# EAGLE design PowerCircuit (EAGLE 8.4.1)
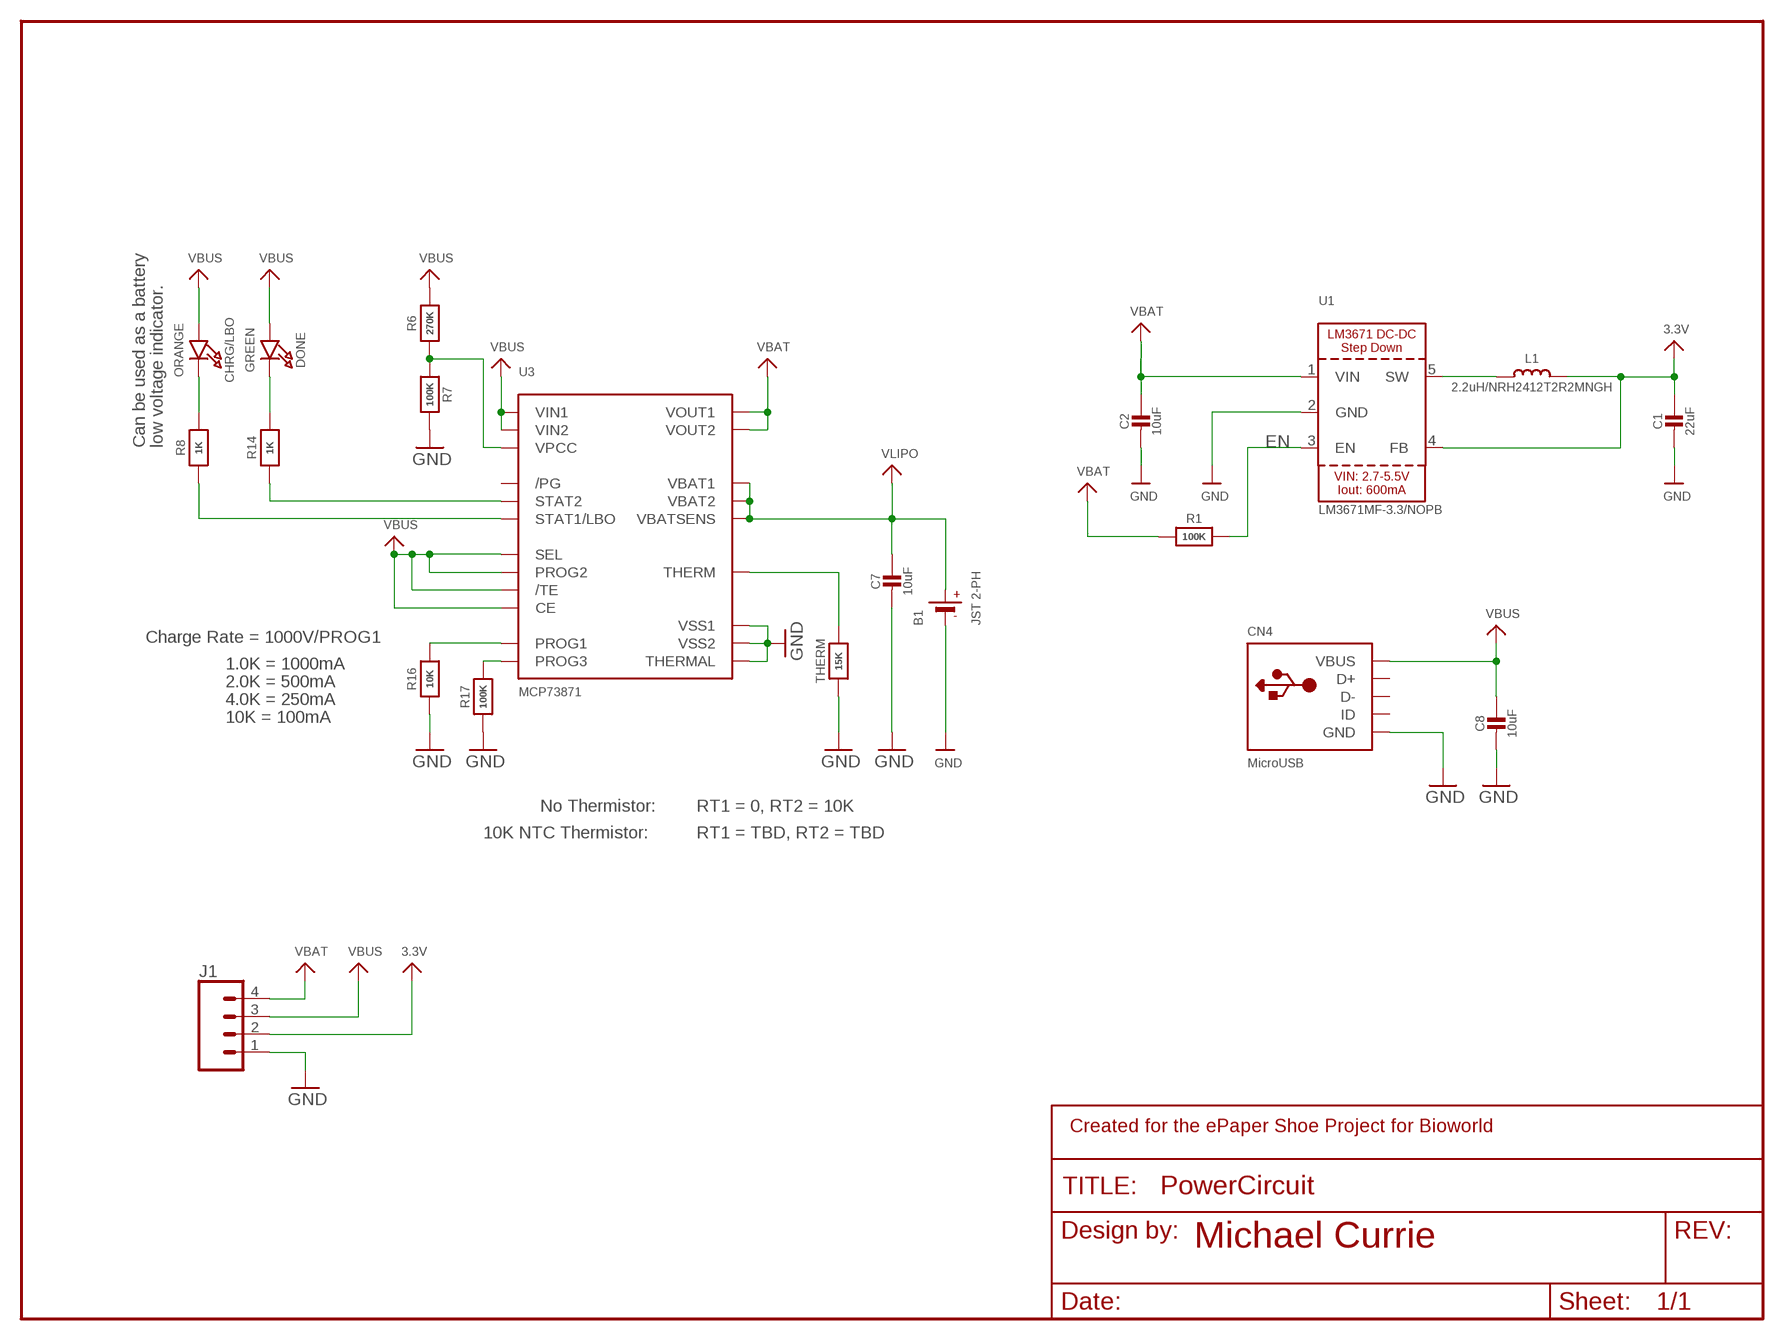
[diagram p0: schematic, sheet 1]

## Parts
B1  JST 2-PH  BATTERY  [JSTPH2]
C1  22uF  CAP_CERAMIC0805-NOOUTLINE  [0805-NO]
C2  10uF  CAP_CERAMIC0805-NOOUTLINE  [0805-NO]
C7  10uF  CAP_CERAMIC0805-NOOUTLINE  [0805-NO]
C8  10uF  CAP_CERAMIC0805-NOOUTLINE  [0805-NO]
CHRG/LBO  ORANGE  LED0805_NOOUTLINE  [CHIPLED_0805_NOOUTLINE]
CN4  MicroUSB  USBMICRO_20329  [4UCONN_20329]
DONE  GREEN  LED0805_NOOUTLINE  [CHIPLED_0805_NOOUTLINE]
FRAME1  FRAME-LETTER-MICHAELNO_PACKAGE  [DUMMY]
J1  CONN_04  [1X04]
L1  2.2uH/NRH2412T2R2MNGH  INDUCTORNRH2412T  [INDUCTOR_TAIYOYUDEN_NRH2412T]
R1  100K  RESISTOR0805_NOOUTLINE  [0805-NO]
R6  270K  RESISTOR0805_NOOUTLINE  [0805-NO]
R7  100K  RESISTOR0805_NOOUTLINE  [0805-NO]
R8  1K  RESISTOR0805_NOOUTLINE  [0805-NO]
R14  1K  RESISTOR0805_NOOUTLINE  [0805-NO]
R16  10K  RESISTOR0805_NOOUTLINE  [0805-NO]
R17  100K  RESISTOR0805_NOOUTLINE  [0805-NO]
THERM  15K  RESISTOR0805_NOOUTLINE  [0805-NO]
U1  LM3671MF-3.3/NOPB  VREG_LM3671  [SOT23-5]
U3  MCP73871  [QFN20_4MM]

## Nets
3.3V: C1.1 J1.2 L1.2 U1.4(FB)
EN: R1.2 U1.3(EN)
GND: B1.1(-) C1.2 C2.2 C7.2 C8.2 CN4.BASE@1(GND) CN4.BASE@2(GND) CN4.GND CN4.SPRT@1(GND) CN4.SPRT@2(GND) CN4.SPRT@3(GND) CN4.SPRT@4(GND) J1.1 R7.2 R16.1 R17.1 THERM.1 U1.2(GND) U3.P$10(VSS1) U3.P$11(VSS2) U3.P$21(THERMAL)
N$1: L1.1 U1.5(SW)
N$7: R6.1 R7.1 U3.P$2(VPCC)
N$8: DONE.C R14.2
N$9: R14.1 U3.P$7(STAT2)
N$10: THERM.2 U3.P$5(THERM)
N$11: R8.1 U3.P$8(STAT1/LBO)
N$12: CHRG/LBO.C R8.2
N$13: R17.2 U3.P$12(PROG3)
N$16: R16.2 U3.P$13(PROG1)
VBAT: C2.1 J1.4 R1.1 U1.1(VIN) U3.P$1(VOUT1) U3.P$20(VOUT2)
VBUS: C8.1 CHRG/LBO.A CN4.VBUS DONE.A J1.3 R6.2 U3.P$3(SEL) U3.P$4(PROG2) U3.P$9(/TE) U3.P$17(CE) U3.P$18(VIN1) U3.P$19(VIN2)
VLIPO: B1.2(+) C7.1 U3.P$14(VBAT1) U3.P$15(VBAT2) U3.P$16(VBATSENS)
Unconnected: CN4.D+ CN4.D- CN4.ID U3.P$6(/PG)

## Notes on the sheet
- Can be used as a battery | low voltage indicator.
- Charge Rate = 1000V/PROG1
- 1.0K = 1000mA
- 2.0K = 500mA
- 4.0K = 250mA
- 10K = 100mA
- No Thermistor: | RT1 = 0, RT2 = 10K
- 10K NTC Thermistor: | RT1 = TBD, RT2 = TBD

## Library data of the parts
B1 = microbuilder:BATTERY: CR1220 SMT - Digikey: 3001K-ND CD2032 BAT-HLD-001 - Digikey: BAT-HLD-001-ND
C1 C2 C7 C8 = microbuilder:CAP_CERAMIC: Ceramic Capacitors For new designs, use the packages preceded by an '_' character since they are more reliable: The following footprints should be used on most boards: _0402 - Standard footprint for regular board layouts _0603 - Standard footprint for regular board layouts _0805 - Standard footprint for regular board layouts _1206 - Standard footprint for regular board layouts For extremely tight-pitch boards where space is at a premium, the following 'micro-pitch' footprints can be used (smaller pads, no silkscreen outline, etc.): _0402MP - Micro-pitch footprint for very dense/compact boards _0603MP - Micro-pitch footprint for very dense/compact boards _0805MP - Micro-pitch footprint for very dense/compact boards _1206MP - Micro-pitch footprint for very dense/compact boards
CHRG/LBO DONE = microbuilder:LED: LED 0603 - 0603 Surface Mount Package 2mA: Green LED - Low Power (3.9mcd, 2ma, 1.7Vf) - Digikey: 475-2709-2-ND Orange LED - Low Power (9.8mcd, 2ma, 1.8Vf) - Digikey: 475-1194-2-ND Red LED - Low Power (5mcd, 2ma, 1.8Vf) - Digikey: 475-1195-2-ND Yellow LED - Low Power (7mcd, 2ma, 1.8Vf) - Digikey: 475-1196-2-ND 5mA: Blue LED - Low Power (17mcd, 5ma, 2.9Vf) - Digikey: LNJ937W8CRACT-ND 0805 - 0805 Surface Mount Package 2mA: Red LED (8.8mcd, 2mA, 1.8Vf, Clear) - Low Power [Digikey: 475-2510-1-ND] Green LED (5mcd, 2mA, 1.8Vf, Clear) - Low Power [Digikey: 475-2730-1-ND] Yellow LED (11.3mcd, 2mA, 1.8Vf, Clear) - Low Power [Digikey: 475-2555-1-ND] 20mA: Red LED (104mcd, 20mA, Diffused) - LS R976 [Digikey: 475-1278-6-ND] Red LED (12mcd, 20mA, 2.0Vf, Clear) - APT2012EC [Digikey: 754-1128-1-ND] Green LED (15mcd, 20mA, 2.2Vf, Clear) - APT2012GC [Digikey: 754-1131-1-ND] Orange LED (160mcd, 20mA, 2.1Vf, Clear) - APT2012SECK [Digikey: 754-1130-1-ND] 1206 - 1206 Surface Mount Package Green LED (26mcd, 20mA, Diffused) - LG N971 [Digikey: 475-1407-6-ND] Red LED (15mcd, 20mA, Diffused) - LH N974 [Digikey: 475-1416-6-ND] Cree - Cree High-Power Surface Mount LEDs XPEBWT-L1-0000-00D50 - White 111lm 350mA 2.9Vf 6200K 110�° XTEAWT-00-0000-00000LEE3 - White 114lm 350mA 2.85Vf 5000K 115�° Everlight - Everlight 45-21 Series Surface Mount LEDs 45-21/QK2C-B2832AC2CB2/2T - Warm White 2000mcd 20mA 3.25Vf 3050K 120�° 45-21/LK2C-B38452C4CB2/2T - Nuetral White 2000mcd 20mA 3.25Vf 4150K 120�° 45-21/LK2C-B50634C6CB2/2T - Cold White 2200mcd 20mA 3.25Vf 5650K 120�° PLCC2 Reverse Mount LS T77K-J1L2-1-0-2-R18-Z - Red 11.25mcd 2mA 1.8Vf 630nm 120�° LO T77K-L1M2-24-Z - Orange 19.6mcd 2mA 1.8Vf 606nm 120�° LY T77K-K2M1-26-Z - Yellow 15.7mcd 2mA 1.8Vf 587nm 120�°
CN4 = microbuilder:USB: USB Connectors USBMINIB - Surface Mount Female Mini-B USB Connector 4UConnector: 06564
FRAME1 = SparkFun-Aesthetics:FRAME-LETTER-MICHAEL: Schematic Frame - Letter Standard 8.5x11 US Letter frame; DESIGNER: Nobody; VERSION: v01
J1 = SparkFun-Connectors:CONN_04: Multi connection point. Often used as Generic Header-pin footprint for 0.1 inch spaced/style header connections On any of the 0.1 inch spaced packages, you can populate with these: Break Away Headers - Straight <https://www.sparkfun.com/products/116> (PRT-00116) Break Away Male Headers - Right Angle <https://www.sparkfun.com/products/553> (PRT-00553) Female Headers <https://www.sparkfun.com/products/115> (PRT-00115) Break Away Headers - Machine Pin <https://www.sparkfun.com/products/117> (PRT-00117) Break Away Female Headers - Swiss Machine Pin <https://www.sparkfun.com/products/743> (PRT-00743) For SCREWTERMINALS and SPRING TERMINALS visit here: Screw Terimnals on SparkFun.com <https://www.sparkfun.com/search/results?term=Screw+Terminals> (5mm/3.5mm/2.54mm spacing) This device is also useful as a general connection point to wire up your design to another part of your project. Our various solder wires solder well into these plated through hole pads. Hook-Up Wire - Assortment (Stranded, 22 AWG) <https://www.sparkfun.com/products/11375> (PRT-11375) Hook-Up Wire - Assortment (Solid Core, 22 AWG) <https://www.sparkfun.com/products/11367> (PRT-11367) View the entire wire category on our website here <https://www.sparkfun.com/categories/141> Special notes: Molex polarized connector foot print use with SKU : PRT-08231 with associated crimp pins and housings. 1MM SMD Version SKU: PRT-10208; PROD_ID: CONN-09696
L1 = microbuilder:INDUCTOR: Inductors 0603: 10nH Ceramic Inductor - microwire antenna/RF (Digikey: 712-1434-2-ND) 0805: 560nH Ceramic Inductor - RF (Digikey: 553-1047-1-ND) 270nH Ceramic Inductor - Q = 40@250MHz, +-5%, 1 Ohm DC Resistance (Digikey: 535-10506-2-ND) 1007 (2518 Metric) SMT: 10µH 10% 250mOhm 820mA 1007 Inductor (Digikey: 587-2189-1-ND) 22µH 10% 500mOhm 580mA 1007 Inductor (Digikey: 587-2190-1-ND) 47µH 10% 950mOhm 420mA 1007 Inductor (Digikey: 587-2191-1-ND) 47µH 5% 100mOhm 1A 1008 Inductor (Digikey: 732-1816-1-ND) 5.0x5.0mm (Taiyo Yuden NR5040 Series) 6.8µH 20% 2.3A 64mOhm Inductor (Digikey: 587-2374-2-ND) 5.0x5.0mm (TDK VLC5045 Series) 4.7µH 20% 3.3A 34mOhm Inductor (Digikey: 445-6526-1-ND) 6.8µH 20% 2.7A 46mOhm Inductor (Digikey: 445-6527-1-ND) 6.0x6.0mm (TDK VLC6045 Series) 4.7µH 20% 3.8A 27mOhm Inductor (Digikey: 445-6538-2-ND) 6.8µH 20% 3A 41mOhm Inductor (Digikey: 445-6540-1-ND) 6.2µH 30% 2.2A 45mOhm Inductor (Digikey: SRR5028-6R2YCT-ND) - Not TDK VLC6045 but footprint should match 6.0x6.0mm (TDK SLF6045 Series) 6.8uH 30% 2A 33mOhm Inductor (Digikey: 445-4572-1-ND, Mouser: 810-SLF645T6R8N2R0PF) 6.0x6.0mm (Sumida CDRH5D28 Series) 6.2uH 30% 1.8A 45mOhm Inductor (Digikey: 308-1542-1-ND) Taiyo Yuden NR3015T2R2M - 2.2uH 20% 1.5A (Digikey: 587-1648-2-ND, Mouser: 963-NR3015T2R2M) - Used with TI TPS62172 CoilCraft RFID Transponder Coil - MA5532-AE (For use with AS3935 Lightning Sensor) Taiyo Yuden NRH2412T2R2MNGH - 2.2uH 20% 1AA (Digikey: 587-3443-1-ND) - Used with TI LM3671 Vishay IHLP 1.0uH Molded Inductor - 24mOhm DCR, 5A, +/-20%, -55°C-125°C (Digikey: 541-1319-1-ND)
R1 R6-R8 R14 R16 R17 THERM = microbuilder:RESISTOR: Resistors For new designs, use the packages preceded by an '_' character since they are more reliable: The following footprints should be used on most boards: _0402 - Standard footprint for regular board layouts _0603 - Standard footprint for regular board layouts _0805 - Standard footprint for regular board layouts _1206 - Standard footprint for regular board layouts For extremely tight-pitch boards where space is at a premium, the following 'micro-pitch' footprints can be used (smaller pads, no silkscreen outline, etc.): _0402MP - Micro-pitch footprint for very dense/compact boards _0603MP - Micro-pitch footprint for very dense/compact boards _0805MP - Micro-pitch footprint for very dense/compact boards _1206MP - Micro-pitch footprint for very dense/compact boards
U1 = microbuilder:VREG_LM3671: LM3671 - 600mA DC-DC Step-Down Converter VIN: 2.7-5.5V Load Current: 600mA Switching Frequency: 2MHz Iq: 16uA
U3 = microbuilder:MCP73871: MCP73871 Lithium Polymer Battery Charger Digikey: MCP73871-2CCI/ML-ND

## Board
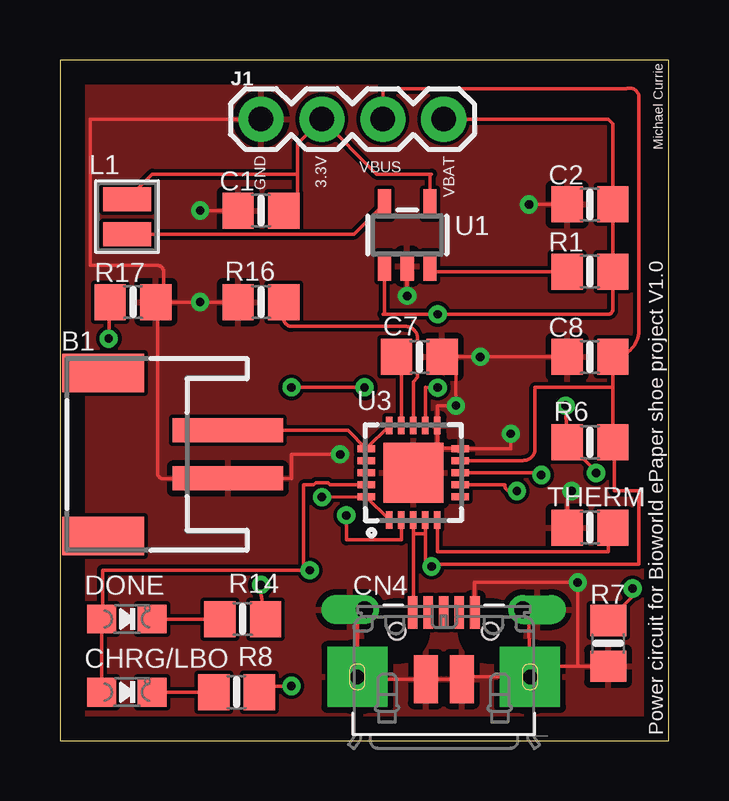
[diagram p1: board, top side]
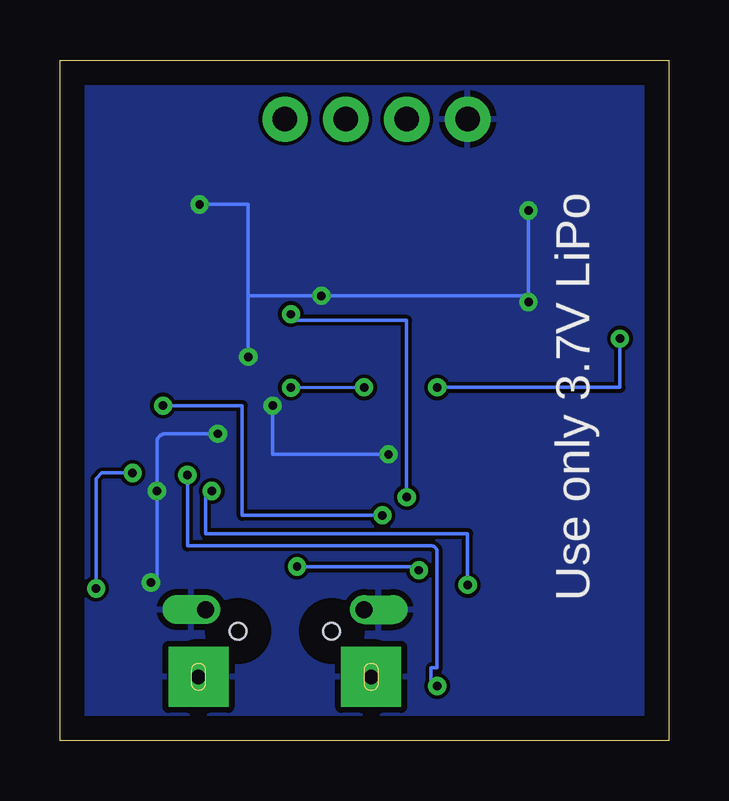
[diagram p2: board, bottom side, seen from below]

Size 25.38 x 28.37 mm. Coordinates in mm from the lower left corner, seen from the top.
Outline: 0,0 25.38,0 25.38,28.37 0,28.37 0,0
Copper layers (1*16): Top 0.035mm / dielectric 1.5mm / Bottom 0.035mm
Design rules "default": minimum track width 6mil, minimum drill 0.35mm, track to track 6mil, track to pad 6mil, pad to pad 6mil, via to via 6mil, smd to smd 6mil, copper to edge 40mil, drill to drill 6mil, minimum pad ring 10mil, minimum via ring 8mil, stop-mask expansion 4mil, vias tented up to drill 0mil, thermal gap 10mil

### Footprints (pad centres in the part's own frame; a part is rotated, then mirrored left to right if it is on the bottom)
JSTPH2 = smd 1 x 4.6: 1 -1,-3.7; 2 1,-3.7 | smd 1.6 x 3.4: NC1 -3.4,1.5; NC2 3.4,1.5
0805-NO = smd 1.3 x 1.5: 1 -0.95,0; 2 0.95,0
CHIPLED_0805_NOOUTLINE = smd 1.2 x 1.2: A 0,-1.05; C 0,1.05
4UCONN_20329 = smd 1 x 2: BASE@1 -0.75,-2; BASE@2 0.75,-2 | smd 0.4 x 1.35: D+ 0,0.775; D- -0.65,0.775; GND 1.3,0.775; ID 0.65,0.775; VBUS -1.3,0.775 | drill 0.7 offset: SPRT@1 -3.3,0.9; SPRT@2 3.3,0.9 | drill 0.6 pad 2.5 square: SPRT@3 -3.6,-1.9; SPRT@4 3.6,-1.9 | hole 0.7: -1.95,0; 1.95,0
1X04 = drill 1.016 pad 1.88: 1 0,0; 2 2.54,0; 3 5.08,0; 4 7.62,0
INDUCTOR_TAIYOYUDEN_NRH2412T = smd 1 x 2: 1 -0.725,0; 2 0.725,0
SOT23-5 = smd 0.55 x 1.2: 1 -0.95,-1.3; 2 0,-1.3; 3 0.95,-1.3; 4 0.95,1.3; 5 -0.95,1.3
QFN20_4MM = smd 0.73 x 0.28: P$1 -1.965,1; P$2 -1.965,0.5; P$3 -1.965,0; P$4 -1.965,-0.5; P$5 -1.965,-1; P$11 1.965,-1; P$12 1.965,-0.5; P$13 1.965,0; P$14 1.965,0.5; P$15 1.965,1 | smd 0.28 x 0.73: P$6 -1,-1.965; P$7 -0.5,-1.965; P$8 0,-1.965; P$9 0.5,-1.965; P$10 1,-1.965; P$16 1,1.965; P$17 0.5,1.965; P$18 0,1.965; P$19 -0.5,1.965; P$20 -1,1.965 | smd 2.5 x 2.5: P$21 0,0

### Placement (x,y rotation side)
B1  3.3,11.94 90 top
C1  8.38,22.1 180 top
C2  22.1,22.35 180 top
C7  14.99,16 0 top
C8  22.1,16 180 top
CHRG/LBO  2.79,2.03 270 top
CN4  16,4.57 0 top
DONE  2.79,5.08 270 top
FRAME1  -10.67,50.04 0 top  (outside the outline)
J1  8.38,25.91 0 top
L1  2.79,21.84 90 top
R1  22.1,19.56 180 top
R6  22.1,12.45 0 top
R7  22.86,4.06 270 top
R8  7.37,2.03 180 top
R14  7.62,5.08 180 top
R16  8.38,18.29 0 top
R17  3.05,18.29 180 top
THERM  22.1,8.89 0 top
U1  14.48,21.08 0 top
U3  14.73,11.18 90 top

### Tracks (layer width: path | path; a pad name or v marks a point on that pad's centre or on a via)
3.3V
  Top 0.152: U1.4 15.43,23.56 15.49,23.62 13.21,23.62 J1.2 9.91,24.89 9.91,23.62 | L1.2 3.85,23.62 9.91,23.62 | C1.1 arc90 9.91,22.67 9.91,23.62
EN
  Top 0.152: R1.2 15.65,19.56 U1.3
GND  (via drill 0.35)
  Top 0.152: 16.51,16 C7.2 | 16.51,16 v17.53,16 C8.2 | 16.51,2.57 CN4.BASE@2 | 16.51,2.57 CN4.BASE@1 12.5,2.57 arc-90 CN4.SPRT@3 12.4,5.17 arc-90 CN4.SPRT@1 | CN4.SPRT@4 16.61,2.67 16.51,2.57 | 4.06,18.29 4.32,18.29 | 4.06,18.29 R17.1 | 4.32,18.29 v5.84,18.29 R16.1 | v5.84,22.1 C1.2 | 4.32,18.29 4.32,19.56 arc90 4.06,19.81 1.27,19.81 1.27,25.91 J1.1 | 4.06,18.29 4.06,11.18 arc90 4.32,10.92 6.99,10.92 arc90 B1.1 9.65,10.92 9.65,11.94 v11.68,11.94 | U1.2 v14.48,18.54 | U3.P$21 15.73,11.18 15.73,12.19 | 15.73,12.19 U3.P$11 15.75,13.97 v16.51,13.97 16.51,16 | 15.73,12.19 16.7,12.19 U3.P$10 18.78,12.18 arc90 18.8,12.19 v18.8,12.8 | v19.56,22.35 C2.2 | CN4.SPRT@4 19.56,4.83 19.56,5.22 arc90 CN4.SPRT@2 | CN4.SPRT@4 arc-90 20.04,3.11 21.59,3.11 | 21.59,3.11 R7.2 | CN4.GND arc-90 17.27,5.38 17.27,6.6 v21.59,6.6 21.59,3.11 | v21.34,10.41 arc90 21.15,10.23 THERM.1
  Bottom 0.152: 5.84,18.54 v5.84,18.29 | 5.84,18.54 v5.84,22.1 | 5.84,18.54 v14.48,18.54 17.53,18.54 | 17.53,18.54 v17.53,16 | 17.53,18.54 17.53,22.35 v19.56,22.35 | v16.51,13.97 16.51,11.94 v11.68,11.94 | v21.59,6.6 arc-90 21.34,6.86 v21.34,10.41 21.34,12.45 arc90 20.98,12.8 v18.8,12.8
  pour Top: 0,28.45 0,0 25.4,0 25.4,28.45
  pour Bottom: 0.25,28.19 0.25,0.25 25.15,0.25 25.15,28.19
N$1
  Top 0.152: L1.1 12.27,21.12 U1.5
N$7  (via drill 0.35)
  Top 0.152: v22.35,11.17 22.35,11.24 R6.1 v21.08,13.97 | R7.1 23.88,6.03 v23.88,6.35 | U3.P$2 14.23,8.39 14.22,8.38 11.94,8.38 v11.94,9.4
  Bottom 0.152: v23.88,6.35 23.88,10.92 23.63,11.17 v22.35,11.17 | v11.94,9.4 17.78,9.4 17.78,13.97 v21.08,13.97
N$8
  Top 0.152: DONE.C R14.2
N$9  (via drill 0.35)
  Top 0.152: R14.1 8.32,6.44 arc-90 v8.38,6.51 | v19.05,10.41 18.8,10.41 arc-90 18.54,10.67 U3.P$7 arc-90 U3.P$7
  Bottom 0.152: v8.38,6.51 8.38,8.64 19.3,8.64 19.3,10.16 arc90 v19.05,10.41
N$10
  Top 0.152: THERM.2 arc90 22.86,8.7 22.86,7.87 15.75,7.87 arc-90 15.73,7.89 U3.P$5
N$11  (via drill 0.35)
  Top 0.152: R8.1 arc-90 8.82,2.29 v9.65,2.29 | v20.07,11.08 arc90 19.97,11.18 U3.P$8
  Bottom 0.152: v9.65,2.29 arc90 9.91,2.54 9.91,3.05 9.65,3.05 9.65,7.87 arc-90 9.91,8.13 20.07,8.13 v20.07,11.08
N$12
  Top 0.152: CHRG/LBO.C R8.2
N$13  (via drill 0.35)
  Top 0.152: U3.P$12 15.24,14.48 15.24,14.73 v15.75,14.72 | v12.7,14.73 v9.65,14.73 | v2.03,16.76 R17.2
  Bottom 0.152: v15.75,14.72 v12.7,14.73 | v9.65,14.73 2.03,14.73 v2.03,16.76
N$16
  Top 0.152: U3.P$13 14.73,14.98 14.91,15.16 14.91,16.76 arc90 14.41,17.27 9.65,17.27 arc-90 9.33,17.59 R16.2
VBAT  (via drill 0.35)
  Top 0.152: J1.4 22.86,25.91 23.05,25.72 C2.1 R1.1 23.05,17.97 arc-90 22.86,17.78 v15.75,17.78 13.46,17.78 arc90 13.53,17.85 U1.1 | U3.P$1 U3.P$20 v10.92,10.16
  Bottom 0.152: v10.92,10.16 10.92,17.53 15.75,17.53 v15.75,17.78
VBUS  (via drill 0.35)
  Top 0.152: 23.05,14.73 R6.2 arc-90 23.11,12.38 23.11,10.41 24.13,10.41 24.13,7.37 15.59,7.37 | 23.05,14.73 C8.1 arc90 24.13,17.08 24.13,26.92 arc90 23.62,27.18 13.46,27.18 J1.3 | CHRG/LBO.A DONE.A arc90 1.78,5.37 1.78,7.11 10.16,7.11 | 10.16,7.11 v10.41,7.11 | U3.P$9 arc-90 U3.P$9 19.3,11.68 arc90 19.81,12.19 19.81,14.73 23.05,14.73 | 15.59,7.37 15.24,7.37 arc-90 15.23,7.37 15.23,8.64 | 15.23,8.64 U3.P$4 | 14.73,8.64 U3.P$3 | 14.73,8.64 15.23,8.64 | CN4.VBUS arc90 14.73,5.38 14.73,8.64 | 15.59,7.37 v15.49,7.27 | U3.P$17 U3.P$18 U3.P$19 11.27,10.67 11.17,10.77 10.67,10.77 10.57,10.67 10.16,10.67 10.16,7.11
  Bottom 0.152: v15.49,7.27 10.57,7.27 v10.41,7.11
VLIPO
  Top 0.152: B1.2 12.01,12.94 U3.P$16 U3.P$15 U3.P$14 14.23,15.81 arc90 C7.1

### Text on the board
tPlace: Michael Currie | GND | 3.3V | VBUS | VBAT | Power circuit for Bioworld ePaper shoe project V1.0
bPlace: Use only 3.7V LiPo